# EAGLE design module_flags_reg (EAGLE 6.5.0)

## Sheet 1 of 6
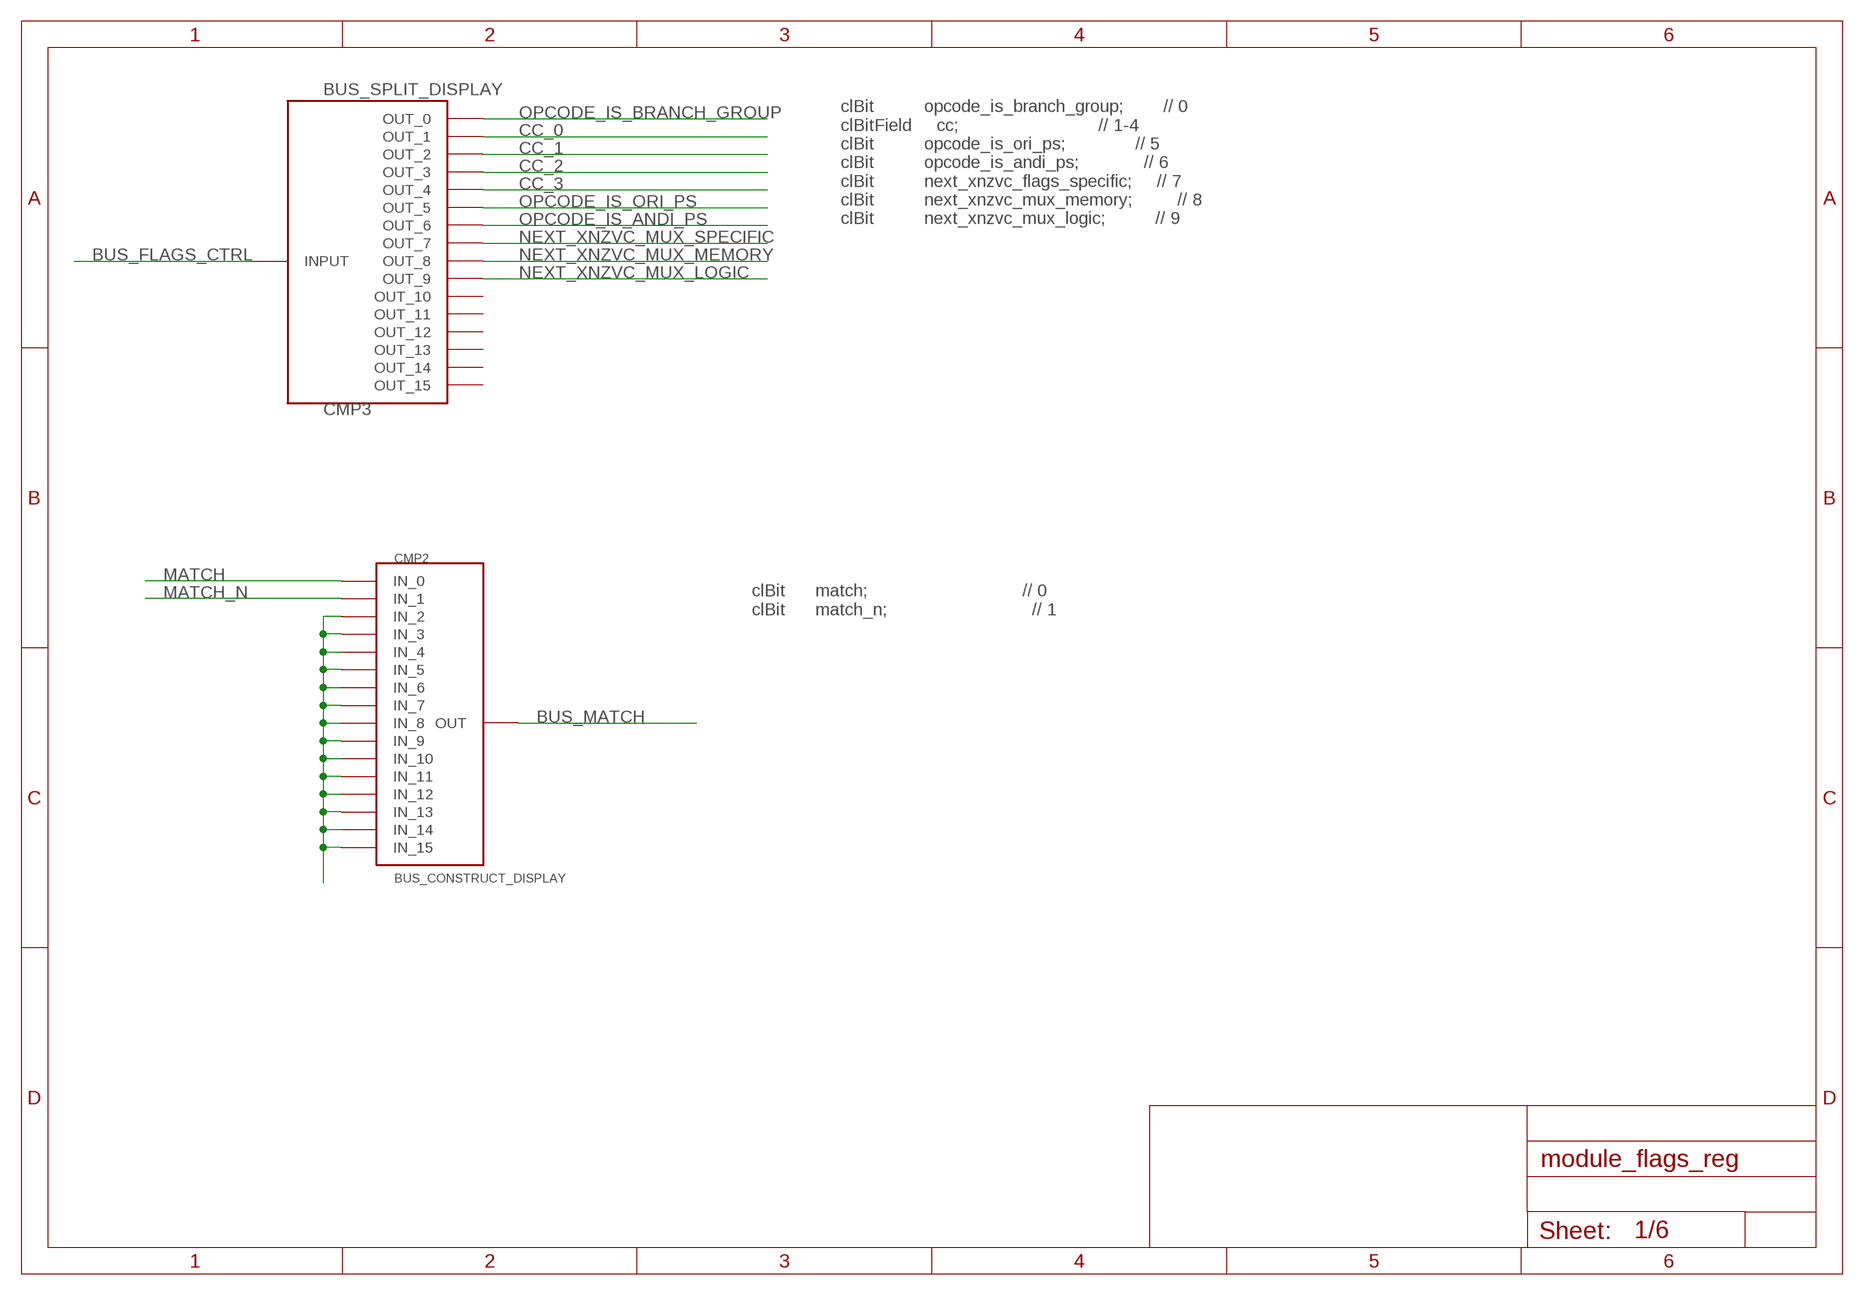
[diagram p0: schematic, sheet 1]

### Parts
CMP2  BUS_CONSTRUCT_DISPLAY  [BUS_SPLIT_DISPLAY]
CMP3  BUS_SPLIT_DISPLAY  [BUS_SPLIT_DISPLAY]

### Nets
BUS_FLAGS_CTRL: CMP3.INPUT
BUS_MATCH: CMP2.INPUT(OUT)
CC_0: CMP3.P$2(OUT_1) ; also sheet 4
CC_1: CMP3.P$3(OUT_2) ; also sheet 4
CC_2: CMP3.P$4(OUT_3) ; also sheet 4
CC_3: CMP3.P$5(OUT_4) ; also sheet 4
MATCH: CMP2.P$1(IN_0) ; also sheet 6
MATCH_N: CMP2.P$2(IN_1) ; also sheet 6
N$6: CMP2.P$3(IN_2) CMP2.P$4(IN_3) CMP2.P$5(IN_4) CMP2.P$6(IN_5) CMP2.P$7(IN_6) CMP2.P$8(IN_7) CMP2.P$9(IN_8) CMP2.P$10(IN_9) CMP2.P$11(IN_10) CMP2.P$12(IN_11) CMP2.P$13(IN_12) CMP2.P$14(IN_13) CMP2.P$15(IN_14) CMP2.P$16(IN_15)
NEXT_XNZVC_MUX_LOGIC: CMP3.P$10(OUT_9) ; also sheet 2
NEXT_XNZVC_MUX_MEMORY: CMP3.P$9(OUT_8) ; also sheet 2
NEXT_XNZVC_MUX_SPECIFIC: CMP3.P$8(OUT_7) ; also sheet 2
OPCODE_IS_ANDI_PS: CMP3.P$7(OUT_6) ; also sheet 3
OPCODE_IS_BRANCH_GROUP: CMP3.P$1(OUT_0) ; also sheet 4
OPCODE_IS_ORI_PS: CMP3.P$6(OUT_5) ; also sheet 3
Unconnected: CMP3.P$11(OUT_10) CMP3.P$12(OUT_11) CMP3.P$13(OUT_12) CMP3.P$14(OUT_13) CMP3.P$15(OUT_14) CMP3.P$16(OUT_15)

### Notes on the sheet
- clBit          opcode_is_branch_group;        // 0
      clBitField     cc;                            // 1-4
      clBit          opcode_is_ori_ps;              // 5
      clBit          opcode_is_andi_ps;             // 6
      clBit          next_xnzvc_flags_specific;     // 7
      clBit          next_xnzvc_mux_memory;         // 8
      clBit          next_xnzvc_mux_logic;          // 9
- clBit      match;                               // 0
      clBit      match_n;                             // 1

## Sheet 2 of 6
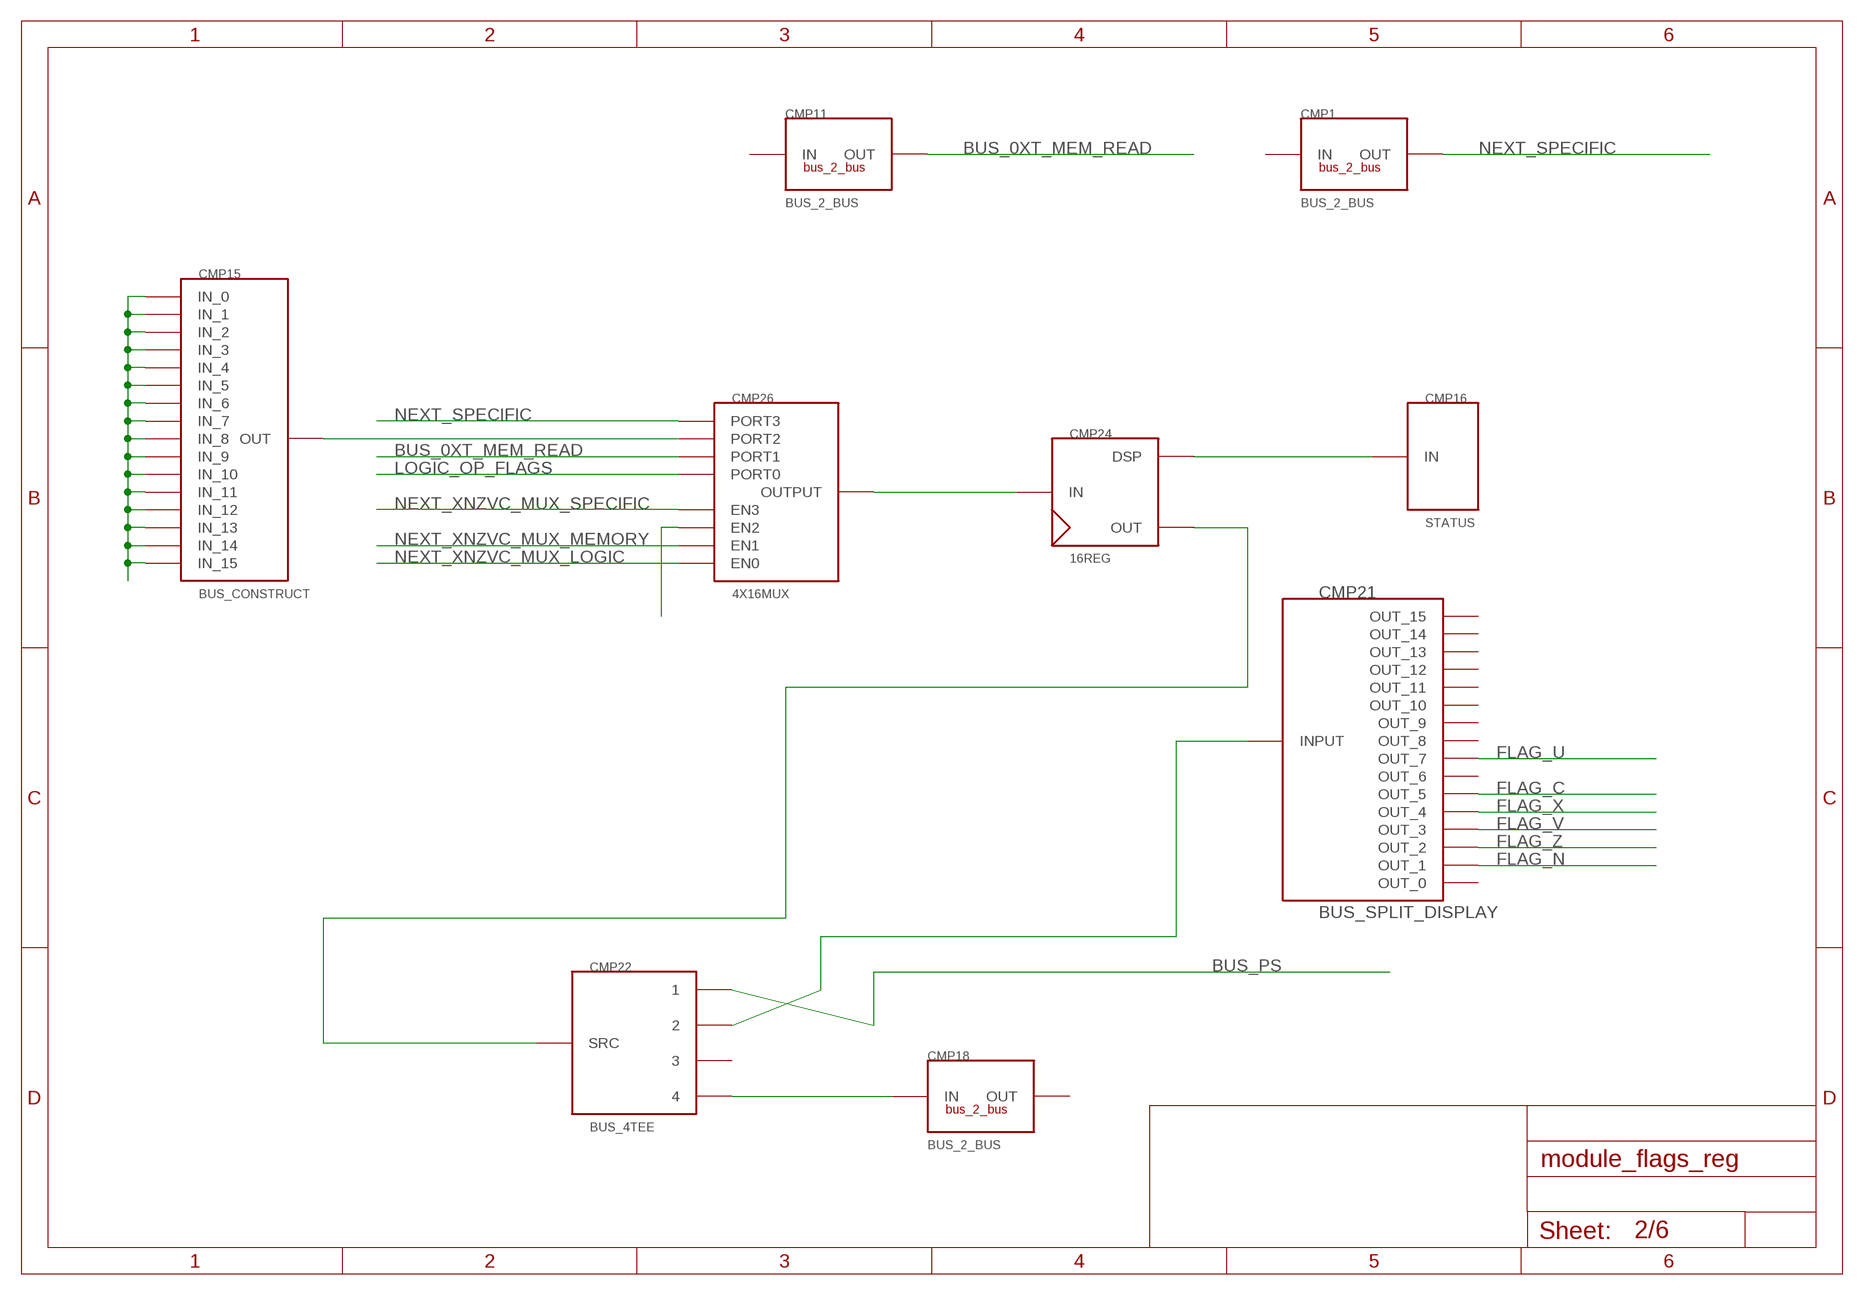
[diagram p1: schematic, sheet 2]

### Parts
CMP1  BUS_2_BUS  [BUS2BUS]
CMP11  BUS_2_BUS  [BUS2BUS]
CMP15  BUS_CONSTRUCT  [BUS_SPLIT]
CMP16  STATUS  [STATUS]
CMP18  BUS_2_BUS  [BUS2BUS]
CMP21  BUS_SPLIT_DISPLAY  [BUS_SPLIT_DISPLAY]
CMP22  BUS_4TEE  [BUS_4TEE]
CMP24  16REG  [16REG]
CMP26  4X16MUX  [4X16MUX]

### Nets
BUS_0XT_MEM_READ: CMP11.P$2(OUT) CMP26.PORT1
BUS_PS: CMP22.1 ; also sheet 3
FLAG_C: CMP21.P$6(OUT_5) ; also sheet 5
FLAG_N: CMP21.P$2(OUT_1) ; also sheet 5
FLAG_U: CMP21.P$8(OUT_7) ; also sheet 5
FLAG_V: CMP21.P$4(OUT_3) ; also sheet 5
FLAG_X: CMP21.P$5(OUT_4)
FLAG_Z: CMP21.P$3(OUT_2) ; also sheet 5
LOGIC_OP_FLAGS: CMP26.PORT0 ; also sheet 3
N$1: CMP16.P$1(IN) CMP24.DISPLAY(DSP)
N$2: CMP22.SRC CMP24.OUT
N$3: CMP18.P$1(IN) CMP22.4
N$4: CMP26.EN2
N$5: CMP15.INPUT(OUT) CMP26.PORT2
N$7: CMP24.INPUT(IN) CMP26.PORTOUT(OUTPUT)
N$11: CMP15.P$1(IN_0) CMP15.P$2(IN_1) CMP15.P$3(IN_2) CMP15.P$4(IN_3) CMP15.P$5(IN_4) CMP15.P$6(IN_5) CMP15.P$7(IN_6) CMP15.P$8(IN_7) CMP15.P$9(IN_8) CMP15.P$10(IN_9) CMP15.P$11(IN_10) CMP15.P$12(IN_11) CMP15.P$13(IN_12) CMP15.P$14(IN_13) CMP15.P$15(IN_14) CMP15.P$16(IN_15)
N$13: CMP21.INPUT CMP22.2
NEXT_SPECIFIC: CMP1.P$2(OUT) CMP26.PORT3
NEXT_XNZVC_MUX_LOGIC: CMP26.EN0 ; also sheet 1
NEXT_XNZVC_MUX_MEMORY: CMP26.EN1 ; also sheet 1
NEXT_XNZVC_MUX_SPECIFIC: CMP26.EN3 ; also sheet 1
Unconnected: CMP1.P$1(IN) CMP11.P$1(IN) CMP18.P$2(OUT) CMP21.P$1(OUT_0) CMP21.P$7(OUT_6) CMP21.P$9(OUT_8) CMP21.P$10(OUT_9) CMP21.P$11(OUT_10) CMP21.P$12(OUT_11) CMP21.P$13(OUT_12) CMP21.P$14(OUT_13) CMP21.P$15(OUT_14) CMP21.P$16(OUT_15) CMP22.3

## Sheet 3 of 6
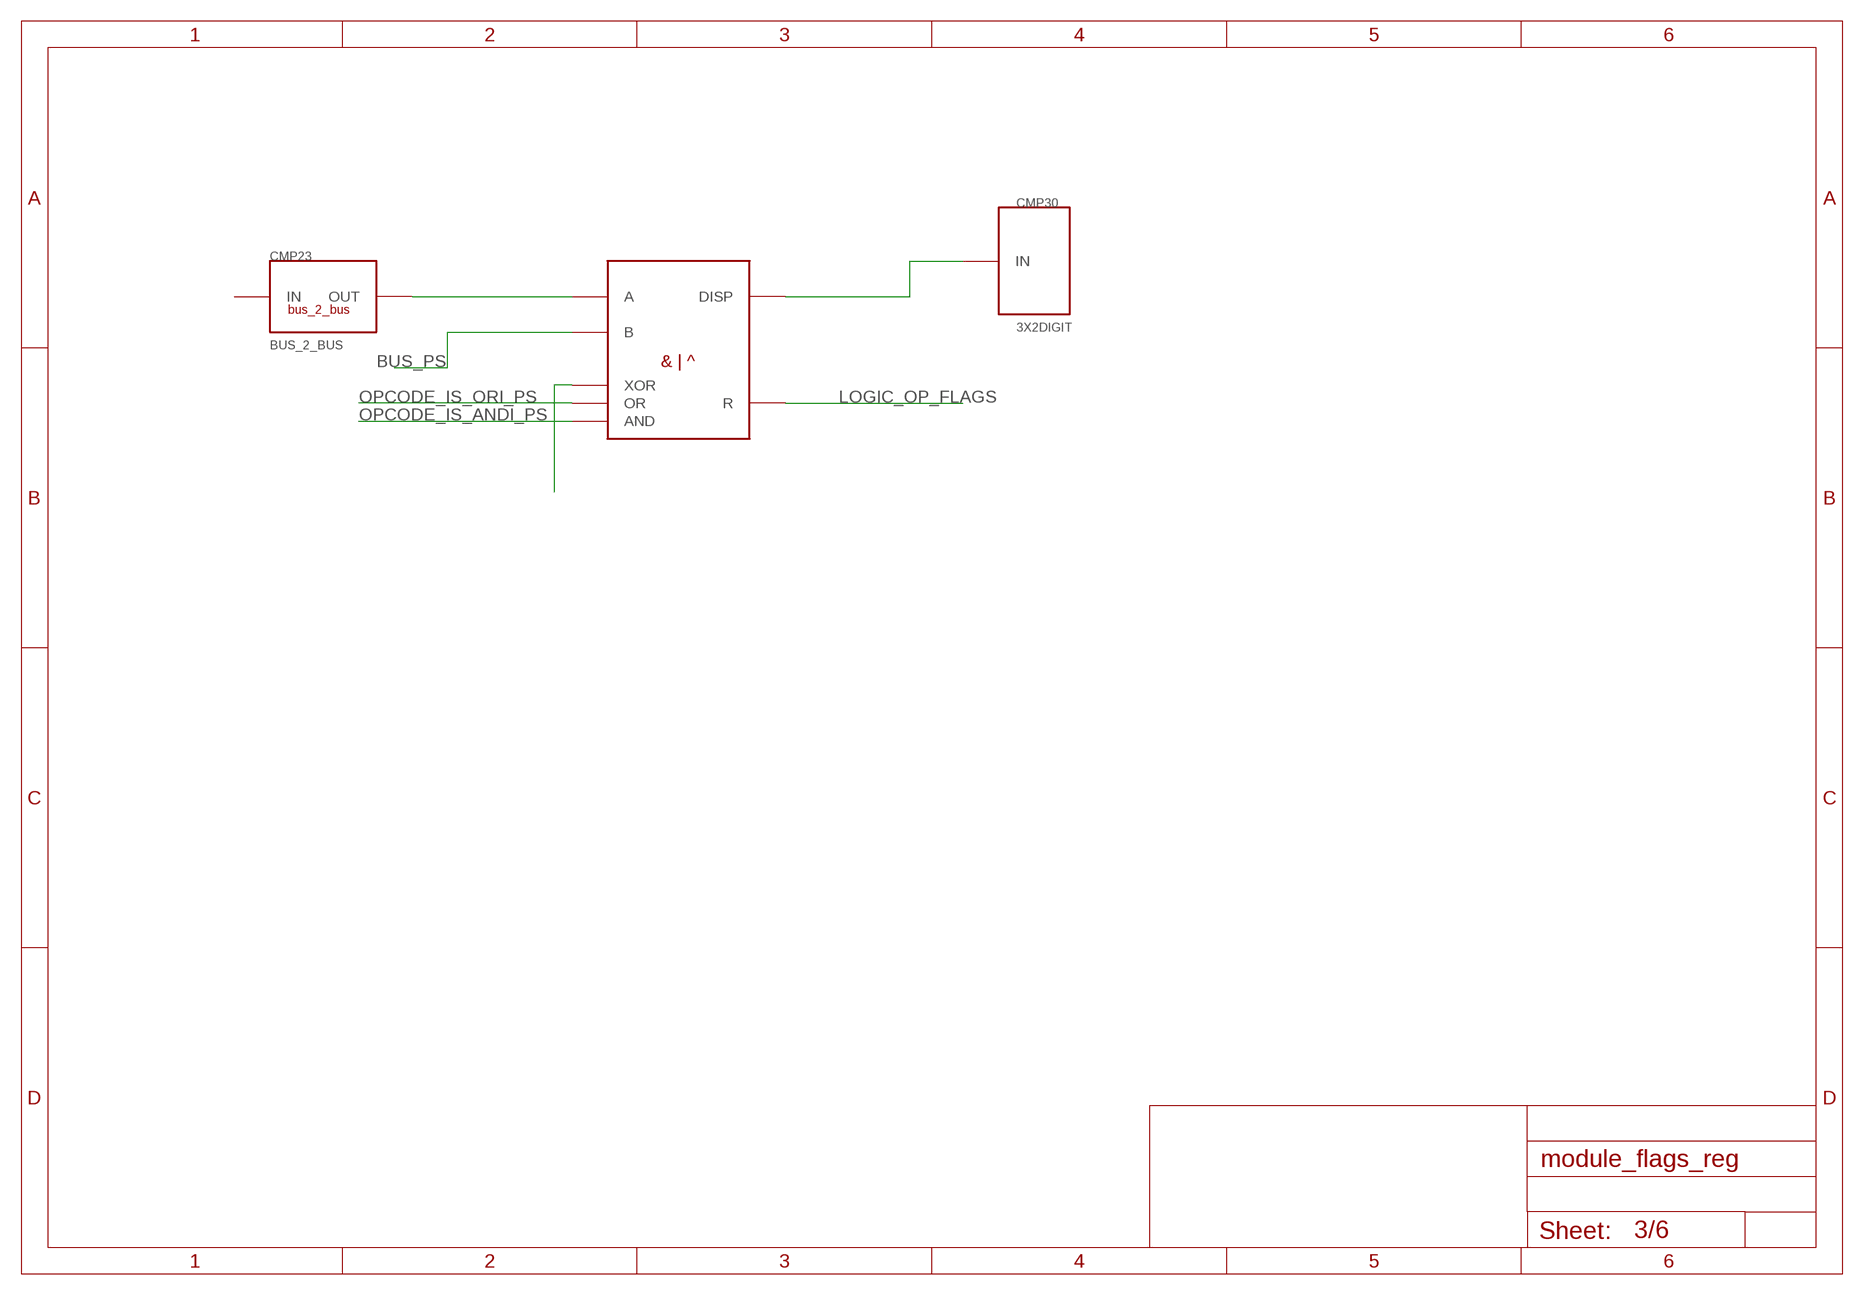
[diagram p2: schematic, sheet 3]

### Parts
CMP23  BUS_2_BUS  [BUS2BUS]
CMP28  8BIT_LOGIC  [8BIT_LOGIC]
CMP30  3X2DIGIT  [3X2DIGIT]

### Nets
BUS_PS: CMP28.B ; also sheet 2
LOGIC_OP_FLAGS: CMP28.R ; also sheet 2
N$9: CMP28.DISP CMP30.P$1(IN)
N$10: CMP28.XOR
N$12: CMP23.P$2(OUT) CMP28.A
OPCODE_IS_ANDI_PS: CMP28.AND ; also sheet 1
OPCODE_IS_ORI_PS: CMP28.OR ; also sheet 1
Unconnected: CMP23.P$1(IN)

## Sheet 4 of 6
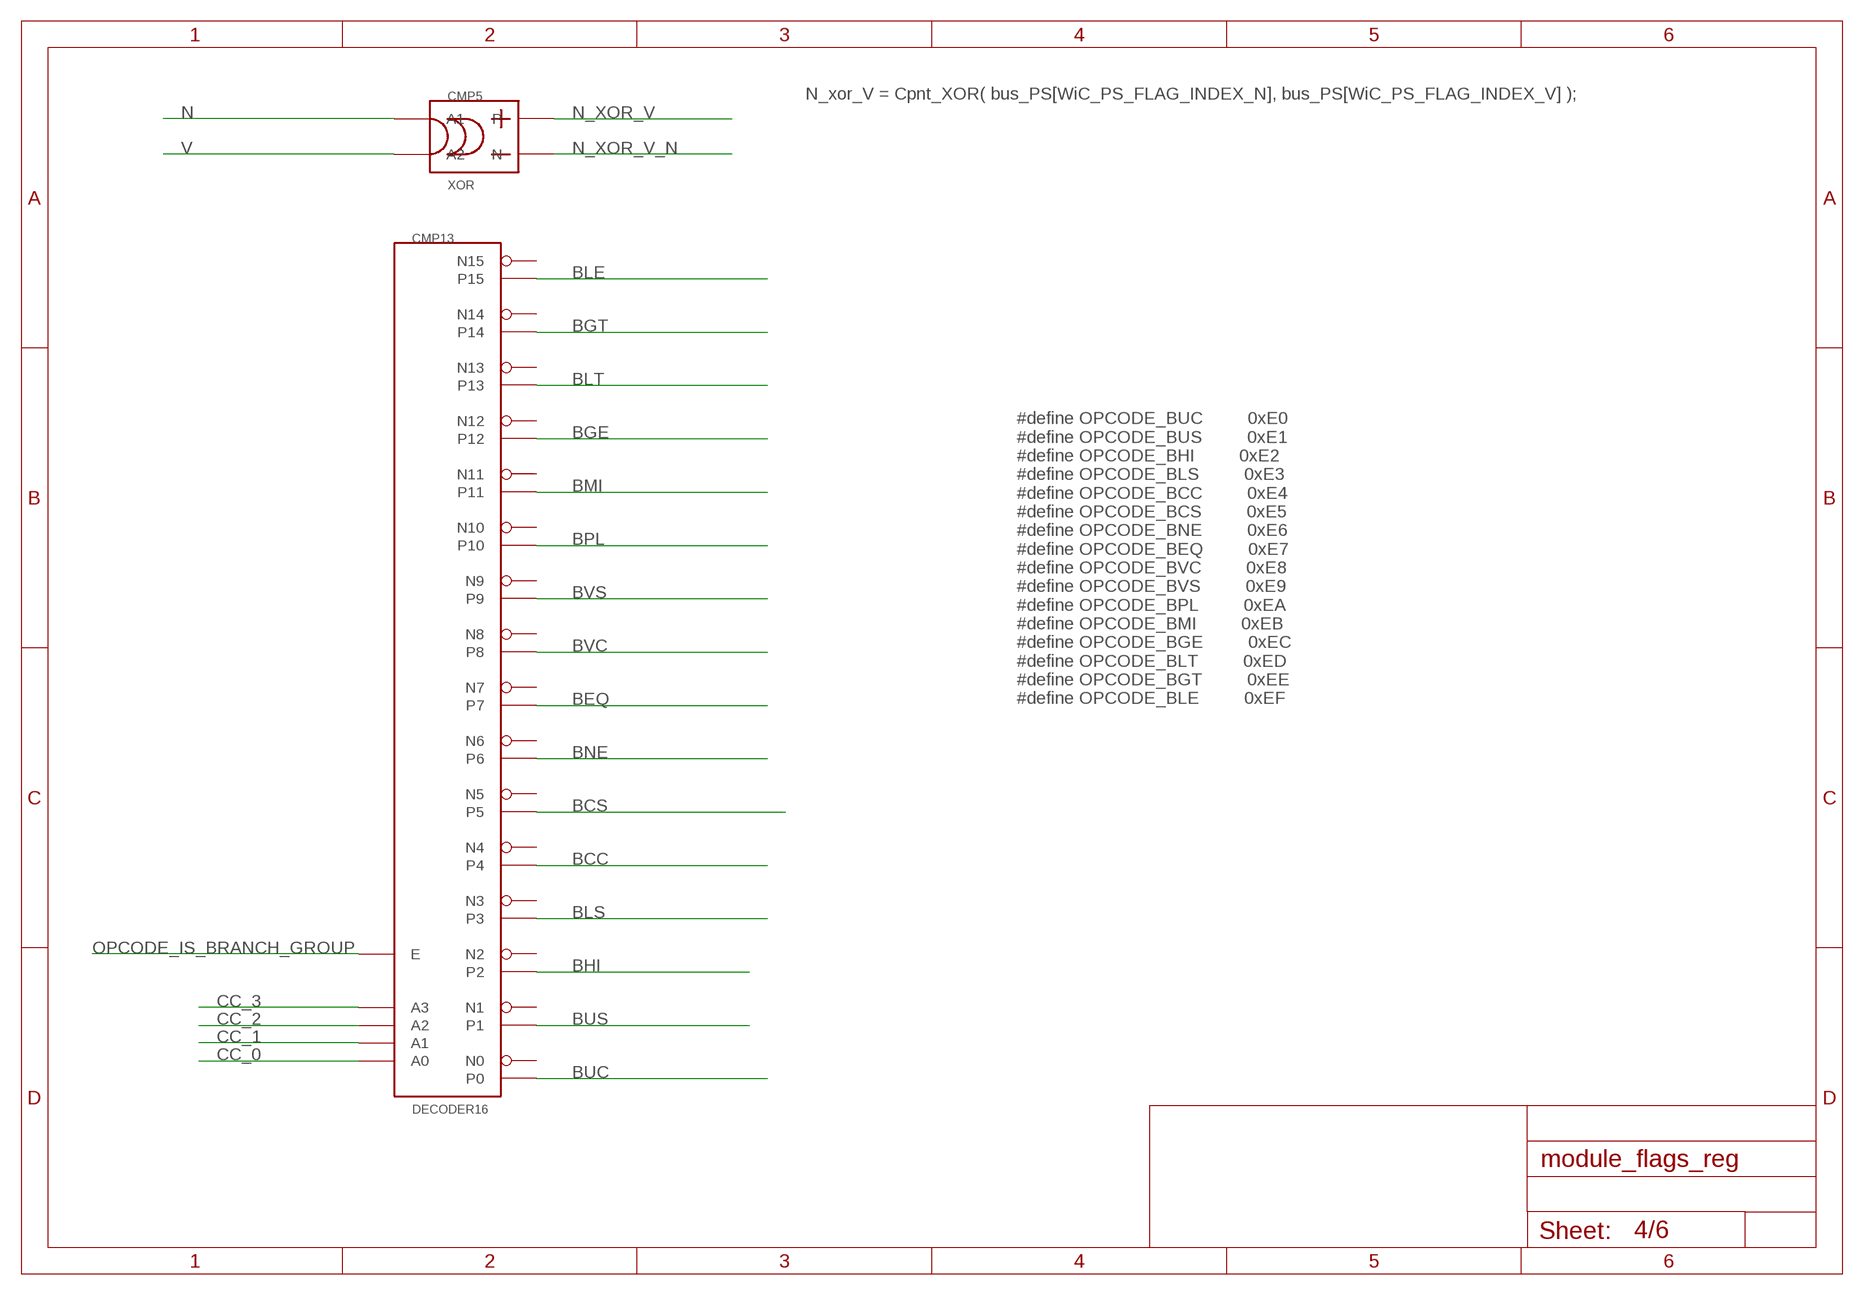
[diagram p3: schematic, sheet 4]

### Parts
CMP5  XOR  [XOR]
CMP13  DECODER16  [DECODER16]

### Nets
BCC: CMP13.P4 ; also sheet 6
BCS: CMP13.P5 ; also sheet 6
BEQ: CMP13.P7 ; also sheet 6
BGE: CMP13.P12 ; also sheet 6
BGT: CMP13.P14 ; also sheet 6
BHI: CMP13.P2 ; also sheet 6
BLE: CMP13.P15 ; also sheet 6
BLS: CMP13.P3 ; also sheet 6
BLT: CMP13.P13 ; also sheet 6
BMI: CMP13.P11 ; also sheet 6
BNE: CMP13.P6 ; also sheet 6
BPL: CMP13.P10 ; also sheet 6
BUC: CMP13.P0 ; also sheet 6
BUS: CMP13.P1 ; also sheet 6
BVC: CMP13.P8 ; also sheet 6
BVS: CMP13.P9 ; also sheet 6
CC_0: CMP13.A0 ; also sheet 1
CC_1: CMP13.A1 ; also sheet 1
CC_2: CMP13.A2 ; also sheet 1
CC_3: CMP13.A3 ; also sheet 1
N: CMP5.P$1(A1) ; also sheet 5,6
N_XOR_V: CMP5.OUT_P(P) ; also sheet 5,6
N_XOR_V_N: CMP5.OUT_N(N) ; also sheet 5,6
OPCODE_IS_BRANCH_GROUP: CMP13.E ; also sheet 1
V: CMP5.P$2(A2) ; also sheet 5,6
Unconnected: CMP13.N0 CMP13.N1 CMP13.N2 CMP13.N3 CMP13.N4 CMP13.N5 CMP13.N6 CMP13.N7 CMP13.N8 CMP13.N9 CMP13.N10 CMP13.N11 CMP13.N12 CMP13.N13 CMP13.N14 CMP13.N15

### Notes on the sheet
- N_xor_V = Cpnt_XOR( bus_PS[WiC_PS_FLAG_INDEX_N], bus_PS[WiC_PS_FLAG_INDEX_V] );
- #define OPCODE_BUC         0xE0
  #define OPCODE_BUS         0xE1
  #define OPCODE_BHI         0xE2
  #define OPCODE_BLS         0xE3
  #define OPCODE_BCC         0xE4
  #define OPCODE_BCS         0xE5
  #define OPCODE_BNE         0xE6
  #define OPCODE_BEQ         0xE7
  #define OPCODE_BVC         0xE8
  #define OPCODE_BVS         0xE9
  #define OPCODE_BPL         0xEA
  #define OPCODE_BMI         0xEB
  #define OPCODE_BGE         0xEC
  #define OPCODE_BLT         0xED
  #define OPCODE_BGT         0xEE
  #define OPCODE_BLE         0xEF

## Sheet 5 of 6
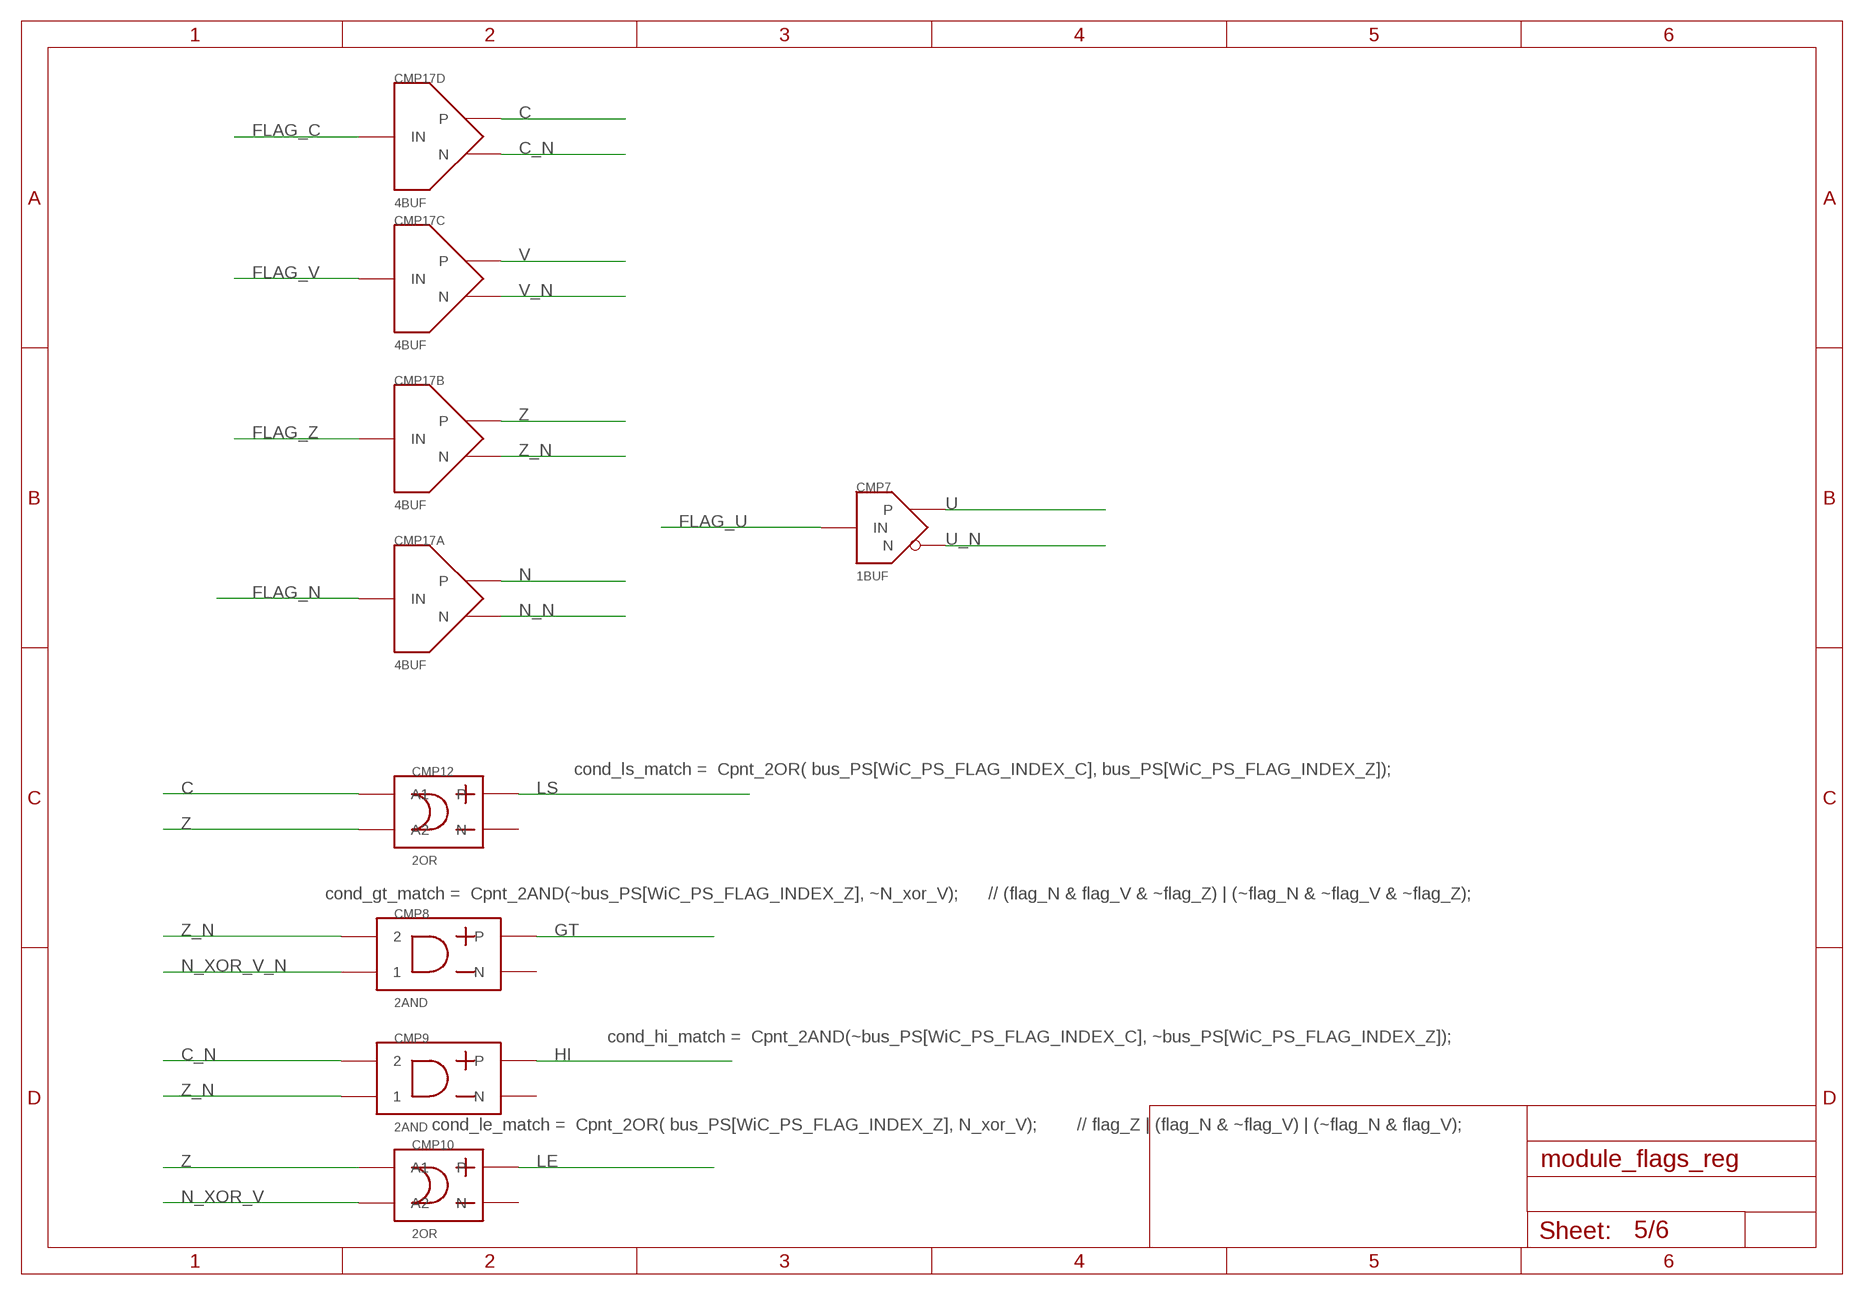
[diagram p4: schematic, sheet 5]

### Parts
CMP7  1BUF  [1BUF]
CMP8  2AND  [2AND]
CMP9  2AND  [2AND]
CMP10  2OR  [2OR]
CMP12  2OR  [2OR]
CMP17  4BUF  [4BUF]

### Nets
C: CMP12.P$2(A1) CMP17.P4(D:P) ; also sheet 6
C_N: CMP9.P$2 CMP17.N4(D:N) ; also sheet 6
FLAG_C: CMP17.A4(D:IN) ; also sheet 2
FLAG_N: CMP17.A1(A:IN) ; also sheet 2
FLAG_U: CMP7.IN ; also sheet 2
FLAG_V: CMP17.A3(C:IN) ; also sheet 2
FLAG_Z: CMP17.A2(B:IN) ; also sheet 2
GT: CMP8.OUT_P(P) ; also sheet 6
HI: CMP9.OUT_P(P) ; also sheet 6
LE: CMP10.OUT_P(P) ; also sheet 6
LS: CMP12.OUT_P(P) ; also sheet 6
N: CMP17.P1(A:P) ; also sheet 4,6
N_N: CMP17.N1(A:N) ; also sheet 6
N_XOR_V: CMP10.P$1(A2) ; also sheet 4,6
N_XOR_V_N: CMP8.P$1 ; also sheet 4,6
U: CMP7.P ; also sheet 6
U_N: CMP7.N ; also sheet 6
V: CMP17.P3(C:P) ; also sheet 4,6
V_N: CMP17.N3(C:N) ; also sheet 6
Z: CMP10.P$2(A1) CMP12.P$1(A2) CMP17.P2(B:P) ; also sheet 6
Z_N: CMP8.P$2 CMP9.P$1 CMP17.N2(B:N) ; also sheet 6
Unconnected: CMP8.OUT_M(N) CMP9.OUT_M(N) CMP10.OUT_M(N) CMP12.OUT_M(N)

### Notes on the sheet
- cond_ls_match =  Cpnt_2OR( bus_PS[WiC_PS_FLAG_INDEX_C], bus_PS[WiC_PS_FLAG_INDEX_Z]);
- cond_gt_match =  Cpnt_2AND(~bus_PS[WiC_PS_FLAG_INDEX_Z], ~N_xor_V);      // (flag_N & flag_V & ~flag_Z) | (~flag_N & ~flag_V & ~flag_Z);
- cond_hi_match =  Cpnt_2AND(~bus_PS[WiC_PS_FLAG_INDEX_C], ~bus_PS[WiC_PS_FLAG_INDEX_Z]);
- cond_le_match =  Cpnt_2OR( bus_PS[WiC_PS_FLAG_INDEX_Z], N_xor_V);        // flag_Z | (flag_N & ~flag_V) | (~flag_N & flag_V);

## Sheet 6 of 6
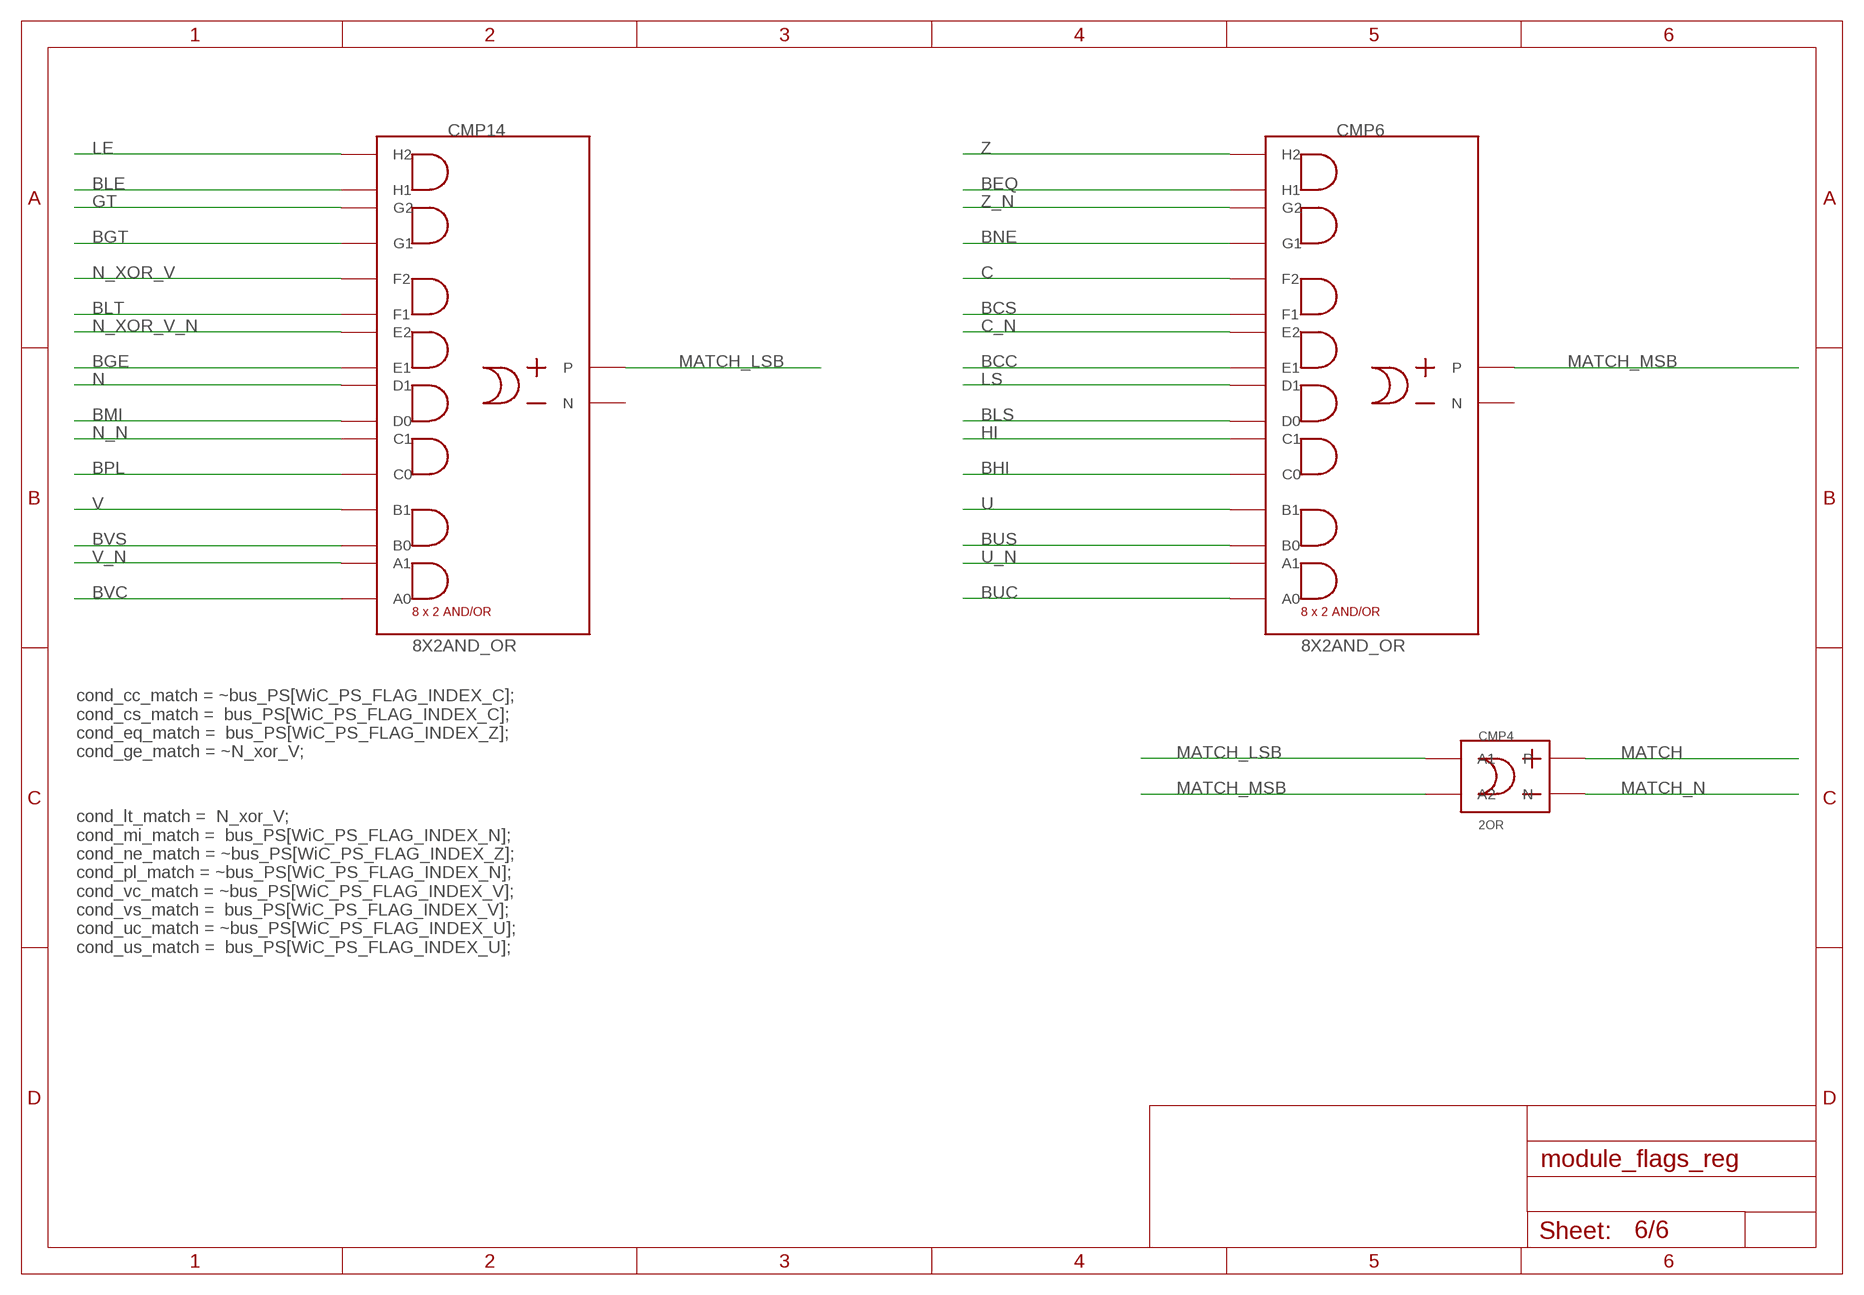
[diagram p5: schematic, sheet 6]

### Parts
CMP4  2OR  [2OR]
CMP6  8X2AND_OR  [8X2AND_OR]
CMP14  8X2AND_OR  [8X2AND_OR]

### Nets
BCC: CMP6.P$9(E1) ; also sheet 4
BCS: CMP6.P$11(F1) ; also sheet 4
BEQ: CMP6.P$15(H1) ; also sheet 4
BGE: CMP14.P$9(E1) ; also sheet 4
BGT: CMP14.P$13(G1) ; also sheet 4
BHI: CMP6.P$5(C0) ; also sheet 4
BLE: CMP14.P$15(H1) ; also sheet 4
BLS: CMP6.P$7(D0) ; also sheet 4
BLT: CMP14.P$11(F1) ; also sheet 4
BMI: CMP14.P$7(D0) ; also sheet 4
BNE: CMP6.P$13(G1) ; also sheet 4
BPL: CMP14.P$5(C0) ; also sheet 4
BUC: CMP6.P$1(A0) ; also sheet 4
BUS: CMP6.P$3(B0) ; also sheet 4
BVC: CMP14.P$1(A0) ; also sheet 4
BVS: CMP14.P$3(B0) ; also sheet 4
C: CMP6.P$12(F2) ; also sheet 5
C_N: CMP6.P$10(E2) ; also sheet 5
GT: CMP14.P$14(G2) ; also sheet 5
HI: CMP6.P$6(C1) ; also sheet 5
LE: CMP14.P$16(H2) ; also sheet 5
LS: CMP6.P$8(D1) ; also sheet 5
MATCH: CMP4.OUT_P(P) ; also sheet 1
MATCH_LSB: CMP4.P$2(A1) CMP14.OUT_P(P)
MATCH_MSB: CMP4.P$1(A2) CMP6.OUT_P(P)
MATCH_N: CMP4.OUT_M(N) ; also sheet 1
N: CMP14.P$8(D1) ; also sheet 4,5
N_N: CMP14.P$6(C1) ; also sheet 5
N_XOR_V: CMP14.P$12(F2) ; also sheet 4,5
N_XOR_V_N: CMP14.P$10(E2) ; also sheet 4,5
U: CMP6.P$4(B1) ; also sheet 5
U_N: CMP6.P$2(A1) ; also sheet 5
V: CMP14.P$4(B1) ; also sheet 4,5
V_N: CMP14.P$2(A1) ; also sheet 5
Z: CMP6.P$16(H2) ; also sheet 5
Z_N: CMP6.P$14(G2) ; also sheet 5
Unconnected: CMP6.OUT_M(N) CMP14.OUT_M(N)

### Notes on the sheet
- cond_cc_match = ~bus_PS[WiC_PS_FLAG_INDEX_C];
      cond_cs_match =  bus_PS[WiC_PS_FLAG_INDEX_C];
      cond_eq_match =  bus_PS[WiC_PS_FLAG_INDEX_Z];
      cond_ge_match = ~N_xor_V;
- cond_lt_match =  N_xor_V;                                        
      cond_mi_match =  bus_PS[WiC_PS_FLAG_INDEX_N];
      cond_ne_match = ~bus_PS[WiC_PS_FLAG_INDEX_Z];
      cond_pl_match = ~bus_PS[WiC_PS_FLAG_INDEX_N];
      cond_vc_match = ~bus_PS[WiC_PS_FLAG_INDEX_V];
      cond_vs_match =  bus_PS[WiC_PS_FLAG_INDEX_V];
      cond_uc_match = ~bus_PS[WiC_PS_FLAG_INDEX_U];
      cond_us_match =  bus_PS[WiC_PS_FLAG_INDEX_U];

## Library data of the parts
CMP1 CMP11 CMP18 CMP23 = modules:BUS_2_BUS
CMP2 = modules:BUS_CONSTRUCT_DISPLAY
CMP3 CMP21 = modules:BUS_SPLIT_DISPLAY
CMP4 CMP10 CMP12 = modules:2OR
CMP5 = modules:XOR
CMP6 CMP14 = modules:8X2AND_OR
CMP7 = modules:1BUF
CMP8 CMP9 = modules:2AND
CMP13 = modules:DECODER16
CMP15 = modules:BUS_CONSTRUCT
CMP16 = modules:STATUS
CMP17 = modules:4BUF
CMP22 = modules:BUS_4TEE
CMP24 = modules:16REG
CMP26 = modules:4X16MUX
CMP28 = modules:8BIT_LOGIC
CMP30 = modules:3X2DIGIT

## Board
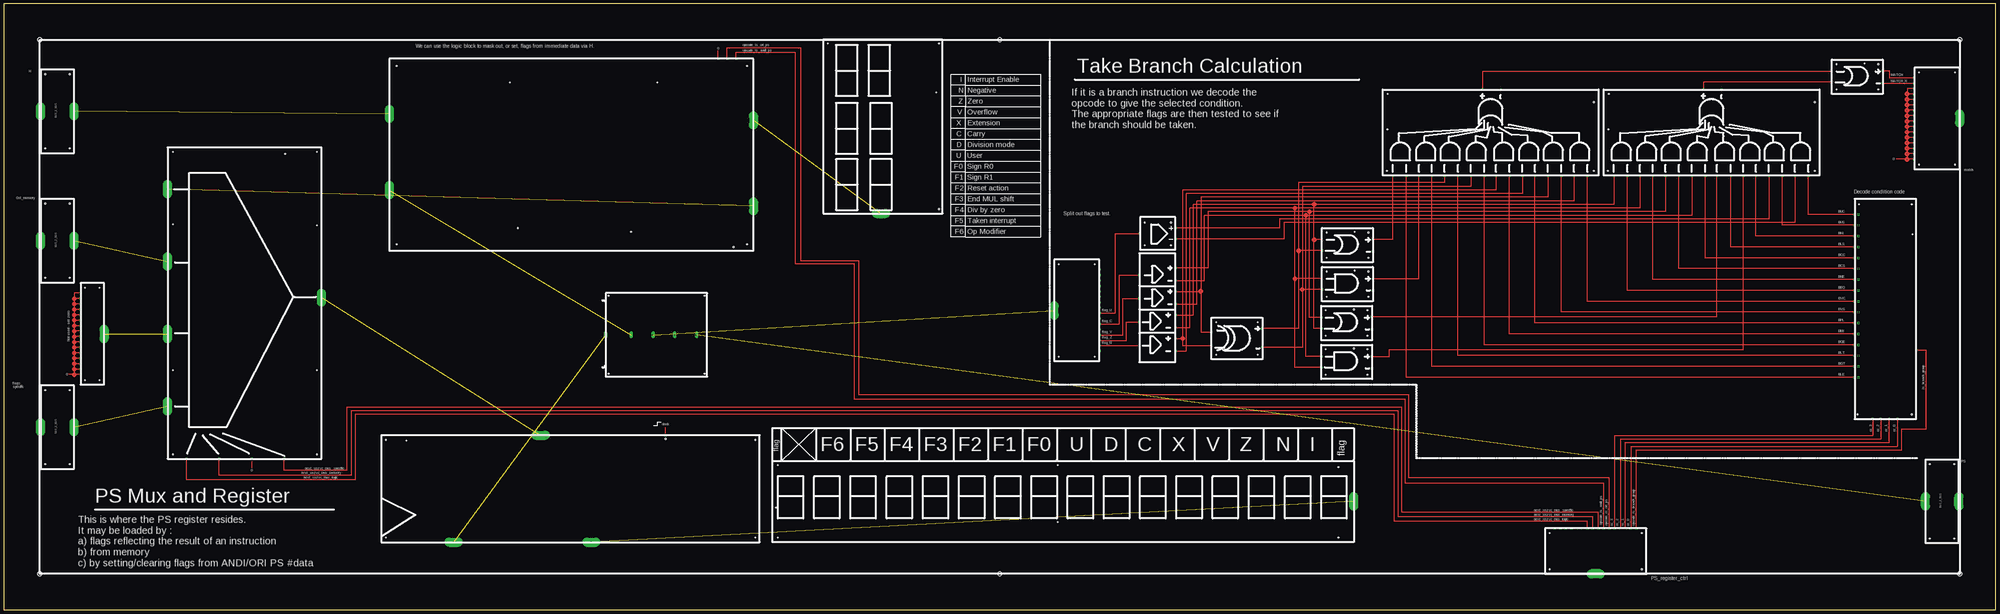
[diagram p6: board, top side]

Size 1397 x 425.45 mm. Coordinates in mm from the lower left corner, seen from the top.
Outline: 0,0 1397,0 1397,425.45 0,425.45 0,0
Copper layers (1*16): Top 0.035mm / dielectric 1.5mm / Bottom 0.035mm
Design rules "default": minimum track width 10mil, minimum drill 24mil, track to track 8mil, track to pad 8mil, pad to pad 8mil, via to via 8mil, smd to smd 8mil, copper to edge 40mil, drill to drill 8mil, minimum pad ring 10mil, minimum via ring 8mil, stop-mask expansion 4mil, vias tented up to drill 0mil, thermal gap 10mil
Holes 2.8 mm at 25.4,400.05 25.4,25.4 698.5,25.4 698.5,400.05 1371.6,400.05 1371.6,25.4
tKeepout: area 16.3,16.3 to 34.5,34.5; area 16.3,390.9 to 34.5,409.2; area 689.4,16.3 to 707.6,34.5; area 689.4,390.9 to 707.6,409.2; area 1362.5,16.3 to 1380.7,34.5; area 1362.5,390.9 to 1380.7,409.2

### Footprints (pad centres in the part's own frame; a part is rotated, then mirrored left to right if it is on the bottom)
BUS2BUS = drill 0.8 pad 6.452 long: P$1 -1.27,12.7; P$2 -1.27,-10.795 | hole 0.6: -27.305,-7.62; -27.305,9.525; 24.765,9.525; 24.765,-7.62
BUS_SPLIT_DISPLAY = drill 0.8 pad 6.452 long: INPUT 0,15.24 | drill 0.8 square: P$1 -28.575,-16.51; P$2 -24.765,-16.51; P$3 -20.955,-16.51; P$4 -17.145,-16.51; P$5 -13.335,-16.51; P$6 -9.525,-16.51; P$7 -5.715,-16.51; P$8 -1.905,-16.51; P$9 1.905,-16.51; P$10 5.715,-16.51; P$11 9.525,-16.51; P$12 13.335,-16.51; P$13 17.145,-16.51; P$14 20.955,-16.51; P$15 24.765,-16.51; P$16 28.575,-16.51 | hole 0.6: -32.385,-13.335; -32.385,12.065; 32.385,12.065; 32.385,-13.335
2OR = drill 0.8 square: OUT_M 17.78,-4.445; OUT_P 17.78,4.445; P$1 -17.78,-3.81; P$2 -17.78,3.81 | hole 0.6: -14.605,8.89; 14.605,-8.89; 14.605,8.89; -14.605,-8.89; 5.08,9.525
XOR = drill 0.8 square: OUT_N 17.78,-6.985; OUT_P 17.78,6.35; P$1 -17.78,-5.715; P$2 -17.78,3.81 | hole 0.6: -14.605,10.795; 14.605,-12.065; 14.605,10.795; -14.605,-12.065
8X2AND_OR = drill 0.8 square: OUT_M 29.845,-8.89; OUT_P 29.845,3.81; P$1 -30.48,-69.85; P$2 -30.48,-60.325; P$3 -30.48,-51.435; P$4 -30.48,-41.91; P$5 -30.48,-33.02; P$6 -30.48,-24.13; P$7 -30.48,-15.24; P$8 -30.48,-5.715; P$9 -30.48,2.54; P$10 -30.48,12.065; P$11 -30.48,20.955; P$12 -30.48,30.48; P$13 -30.48,39.37; P$14 -30.48,48.26; P$15 -30.48,57.15; P$16 -30.48,66.675 | hole 0.6: -27.305,-74.295; 20.955,-74.295; 26.67,70.168; -27.305,70.802; 1.905,70.485
1BUF = drill 0.8 square: IN -12.7,0; N 12.065,-3.81; P 12.065,3.81 | hole 0.6: -9.525,7.62; -9.525,-8.255; 8.89,-8.255; 8.89,7.62
2AND = drill 0.8 square: OUT_M 19.05,-4.445; OUT_P 19.05,3.81; P$1 -16.51,-3.81; P$2 -16.51,3.81 | hole 0.6: -13.335,8.89; 15.875,-8.89; -13.335,-8.89; 15.875,8.89; 6.35,9.525
DECODER16 = drill 0.8 square: A0 -83.82,-8.255; A1 -83.82,-2.54; A2 -83.82,3.175; A3 -83.82,8.89; E -35.56,-21.59; N0 59.69,19.05; N1 52.07,19.05; N2 44.45,19.05; N3 36.83,19.05; N4 29.21,19.05; N5 21.59,19.05; N6 13.97,19.05; N7 6.35,19.05; N8 -1.27,19.05; N9 -8.89,19.05; N10 -16.51,19.05; N11 -24.13,19.05; N12 -31.75,19.05; N13 -39.37,19.05; N14 -46.99,19.05; N15 -54.61,19.05; P0 59.69,21.59; P1 52.07,21.59; P2 44.45,21.59; P3 36.83,21.59; P4 29.21,21.59; P5 21.59,21.59; P6 13.97,21.59; P7 6.35,21.59; P8 -1.27,21.59; P9 -8.89,21.59; P10 -16.51,21.59; P11 -24.13,21.59; P12 -31.75,21.59; P13 -39.37,21.59; P14 -46.99,21.59; P15 -54.61,21.59 | hole 0.6: 66.675,18.415; -80.645,19.685; -80.645,-18.415; 66.675,-18.415; 45.72,-19.05
BUS_SPLIT = drill 0.8 pad 6.452 long: INPUT -0.635,7.62 | drill 0.8 square: P$1 -29.21,-8.89; P$2 -25.4,-8.89; P$3 -21.59,-8.89; P$4 -17.78,-8.89; P$5 -13.97,-8.89; P$6 -10.16,-8.89; P$7 -6.35,-8.89; P$8 -2.54,-8.89; P$9 1.27,-8.89; P$10 5.08,-8.89; P$11 8.89,-8.89; P$12 12.7,-8.89; P$13 16.51,-8.89; P$14 20.32,-8.89; P$15 24.13,-8.89; P$16 27.94,-8.89 | hole 0.6: -33.02,-5.715; -33.02,4.445; 31.75,4.445; 31.75,-5.715
STATUS = drill 0.8 pad 6.452 long: P$1 208.28,-2.54 | hole 0.6: -195.58,-27.94; -195.58,22.86; 197.485,-27.94; 197.485,21.59; 0.635,22.86; 0.635,-17.145; -196.85,-6.985
4BUF = drill 0.8 square: A1 -25.4,13.97; A2 -8.89,13.97; A3 7.62,13.97; A4 24.13,13.97; N1 -29.21,-11.43; N2 -12.7,-11.43; N3 3.81,-11.43; N4 20.32,-11.43; P1 -20.32,-11.43; P2 -3.81,-11.43; P3 12.7,-11.43; P4 29.21,-11.43
BUS_4TEE = drill 0.8 pad 2.54 long: 1 2.54,12.7; 2 2.54,-2.54; 3 2.54,-17.78; 4 2.54,-33.02; SRC 2.54,30.48 | hole 0.6: -24.765,28.575; 29.845,28.575; 29.845,-38.735; -24.765,-38.735
16REG = drill 0.8 pad 6.452 long: DISPLAY 17.78,-33.02; INPUT -17.78,41.91; OUT -78.74,-33.02 | drill 0.8 square: P$1 69.85,41.91 | hole 0.6: -126.365,-29.845; -126.365,38.735; 132.715,38.735; 132.715,-29.845; -111.76,38.1; 69.85,39.37
4X16MUX = drill 0.8 square: EN0 -113.03,38.735; EN1 -113.03,15.875; EN2 -113.03,-6.985; EN3 -113.03,-29.845 | drill 0.8 pad 6.452 long: PORT0 76.2,52.07; PORT1 25.4,52.07; PORT2 -25.4,52.07; PORT3 -76.2,52.07; PORTOUT 0,-55.88 | hole 0.6: -109.855,-52.705; -50.8,-52.705; 50.8,-52.705; 102.235,-52.705; 102.235,48.26; 51.435,48.26; -50.8,48.26; -109.855,48.26; 100.965,-30.48
8BIT_LOGIC = drill 0.8 pad 6.452 long: A -29.845,-140.97; B 23.495,-140.97; DISP -25.4,114.3; R 34.925,114.3 | drill 0.8 square: AND -68.58,102.235; OR -68.58,95.885; XOR -68.58,89.535 | hole 0.6: -63.5,-135.89; -63.5,109.855; 61.595,109.855; 61.595,-135.89; 63.5,100.33; -52.07,46.99; 52.705,28.575; -52.07,-56.515; 50.165,-50.8
3X2DIGIT = drill 0.8 pad 6.452 long: P$1 -0.635,-60.96 | hole 0.6: 38.1,24.13; 40.005,-57.785; 40.005,58.42; -38.1,58.42

### Placement (x,y rotation side)
CMP1  38.73,129.54 90 top
CMP2  1356.36,344.81 270 top
CMP3  1116.33,40.64 180 top
CMP4  1299.85,374.01 0 top
CMP5  864.87,191.13 0 top
CMP6  1195.7,335.28 90 top
CMP7  809.62,264.16 0 top
CMP8  941.07,228.6 0 top
CMP9  940.43,173.99 0 top
CMP10  942.34,255.91 0 top
CMP11  38.73,260.35 90 top
CMP12  941.71,201.29 0 top
CMP13  1319.53,217.81 90 top
CMP14  1040.77,335.28 90 top
CMP15  62.87,193.04 270 top
CMP16  738.5,78.74 0 top
CMP17  810.26,210.82 90 top
CMP18  1360.17,77.47 90 top
CMP21  751.84,210.19 90 top
CMP22  452.75,190.5 90 top
CMP23  38.73,351.15 90 top
CMP24  394.33,80.64 0 top
CMP26  167,219.07 90 top
CMP28  411.48,318.13 270 top
CMP30  615.95,339.09 0 top

### Tracks (layer width: path | path; a pad name or v marks a point on that pad's centre or on a via)
BCC
  Top 0.61: CMP13.P4 1193.16,247.01 CMP6.P$9
BCS
  Top 0.61: CMP13.P5 1174.75,239.4 CMP6.P$11
BEQ
  Top 0.61: CMP13.P7 1138.56,224.16 CMP6.P$15
BGE
  Top 0.61: CMP13.P12 1038.22,186.06 CMP14.P$9
BGT
  Top 0.61: CMP13.P14 1001.39,170.81 CMP14.P$13
BHI
  Top 0.61: CMP13.P2 1228.72,262.25 CMP6.P$5
BLE
  Top 0.61: CMP13.P15 983.62,163.19 CMP14.P$15
BLS
  Top 0.61: CMP13.P3 1210.94,254.63 CMP6.P$7
BLT
  Top 0.61: CMP13.P13 1019.81,178.44 CMP14.P$11
BMI
  Top 0.61: CMP13.P11 1056.01,193.68 CMP14.P$7
BNE
  Top 0.61: CMP13.P6 1156.34,231.78 CMP6.P$13
BPL
  Top 0.61: CMP13.P10 1073.79,201.29 CMP14.P$5
BUC
  Top 0.61: CMP13.P0 1265.56,277.5 CMP6.P$1
BUS
  Top 0.61: CMP13.P1 1247.14,269.88 CMP6.P$3
BUS_0XT_MEM_READ  (1 unrouted)
BUS_PS  (1 unrouted)
BVC
  Top 0.61: CMP13.P8 1110.62,216.53 CMP14.P$1
BVS
  Top 0.61: CMP13.P9 1092.2,208.91 CMP14.P$3
C
  Top 0.61: CMP6.P$12 1165.22,279.4 915.67,279.4 | 915.67,279.4 844.55,279.4 844.55,240.03 CMP17.P4 | CMP12.P$2 915.67,205.1 915.67,279.4
C_N
  Top 0.61: CMP6.P$10 1183.64,276.86 913.13,276.86 | 913.13,276.86 842.01,276.86 842.01,231.14 CMP17.N4 | CMP9.P$2 913.13,177.8 913.13,276.86
CC_0
  Top 0.61: CMP13.A0 1327.79,114.94 1141.1,114.94 CMP3.P$2
CC_1
  Top 0.61: CMP13.A1 1322.07,117.47 1137.29,117.47 CMP3.P$3
CC_2
  Top 0.61: CMP13.A2 1316.36,120.02 1133.47,120.02 CMP3.P$4
CC_3
  Top 0.61: CMP13.A3 1310.64,122.56 1129.66,122.56 CMP3.P$5
FLAG_C
  Top 0.61: CMP21.P$6 782.32,200.66 782.32,234.95 CMP17.A4
FLAG_N
  Top 0.61: CMP21.P$2 CMP17.A1
FLAG_U
  Top 0.61: CMP21.P$8 779.78,208.28 779.78,264.16 CMP7.IN
FLAG_V
  Top 0.61: CMP21.P$4 784.86,193.04 784.86,218.44 CMP17.A3
FLAG_Z
  Top 0.61: CMP21.P$3 787.4,189.23 787.4,201.93 CMP17.A2
GT
  Top 0.61: CMP8.OUT_P 992.5,232.41 CMP14.P$14
HI
  Top 0.61: CMP9.OUT_P 971.55,177.8 971.55,182.88 1219.84,182.88 CMP6.P$6
LE
  Top 0.61: CMP10.OUT_P 974.09,260.35 CMP14.P$16
LOGIC_OP_FLAGS  (1 unrouted)
LS
  Top 0.61: CMP12.OUT_P 1201.42,205.74 CMP6.P$8
MATCH
  Top 0.61: CMP4.OUT_P 1322.07,378.46 1322.07,373.38 CMP2.P$1
MATCH_LSB
  Top 0.61: CMP4.P$2 1036.95,377.82 CMP14.OUT_P
MATCH_MSB
  Top 0.61: CMP4.P$1 1191.89,370.2 CMP6.OUT_P
MATCH_N
  Top 0.61: CMP4.OUT_M CMP2.P$2
N
  Top 0.61: CMP14.P$8 1046.48,294.64 826.77,294.64 826.77,190.5 | 826.77,190.5 826.77,185.42 CMP5.P$1 | CMP17.P1 826.77,190.5
N$1  (1 unrouted)
N$2  (1 unrouted)
N$3  (1 unrouted)
N$5  (1 unrouted)
N$6
  Top 0.61: CMP2.P$3 1334.77,365.76 1334.77,361.95 | 1334.77,361.95 1334.77,358.14 | 1334.77,358.14 1334.77,354.33 | 1334.77,354.33 1334.77,350.52 | 1334.77,350.52 1334.77,346.71 | 1334.77,346.71 1334.77,342.9 | 1334.77,342.9 1334.77,339.09 | 1334.77,339.09 1334.77,335.28 | 1334.77,335.28 1334.77,331.47 | 1334.77,331.47 1334.77,327.66 | 1334.77,327.66 1334.77,323.85 | 1334.77,323.85 1334.77,320.04 | 1334.77,320.04 1334.77,316.23 | 1334.77,316.23 1327.15,316.23 | CMP2.P$16 1334.77,316.23 | CMP2.P$15 1334.77,320.04 | CMP2.P$14 1334.77,323.85 | CMP2.P$13 1334.77,327.66 | CMP2.P$12 1334.77,331.47 | CMP2.P$11 1334.77,335.28 | CMP2.P$10 1334.77,339.09 | CMP2.P$9 1334.77,342.9 | CMP2.P$8 1334.77,346.71 | CMP2.P$7 1334.77,350.52 | CMP2.P$6 1334.77,354.33 | CMP2.P$5 1334.77,358.14 | CMP2.P$4 1334.77,361.95
N$7  (1 unrouted)
N$8
  Top 0.61: 173.99,104.14 173.99,99.69
N$9  (1 unrouted)
N$11
  Top 0.61: CMP15.P$1 49.53,222.25 49.53,218.44 | 49.53,218.44 49.53,214.63 | 49.53,214.63 49.53,210.82 | 49.53,210.82 49.53,207.01 | 49.53,207.01 49.53,203.2 | 49.53,203.2 49.53,199.39 | 49.53,199.39 49.53,195.58 | 49.53,195.58 49.53,191.77 | 49.53,191.77 49.53,187.96 | 49.53,187.96 49.53,184.15 | 49.53,184.15 49.53,180.34 | 49.53,180.34 49.53,176.53 | 49.53,176.53 49.53,172.72 | 49.53,172.72 49.53,168.91 | 49.53,168.91 49.53,165.1 | 49.53,165.1 45.72,165.1 | CMP15.P$16 49.53,165.1 | CMP15.P$15 49.53,168.91 | CMP15.P$14 49.53,172.72 | CMP15.P$13 49.53,176.53 | CMP15.P$12 49.53,180.34 | CMP15.P$11 49.53,184.15 | CMP15.P$10 49.53,187.96 | CMP15.P$9 49.53,191.77 | CMP15.P$8 49.53,195.58 | CMP15.P$2 49.53,218.44 | CMP15.P$4 49.53,210.82 | CMP15.P$3 49.53,214.63 | CMP15.P$5 49.53,207.01 | CMP15.P$6 49.53,203.2 | CMP15.P$7 49.53,199.39
N$12  (1 unrouted)
N$13  (1 unrouted)
N$14
  Top 0.61: 464.19,123.83 464.19,128.27
N$15
  Top 0.61: 501.01,387.99 501.01,392.43
N_N
  Top 0.61: CMP14.P$6 1064.89,292.1 829.31,292.1 829.31,181.61 CMP17.N1
N_XOR_V
  Top 0.61: CMP14.P$12 1010.28,299.72 908.05,299.72 908.05,252.09 | 908.05,252.09 908.05,197.49 CMP5.OUT_P | CMP10.P$1 908.05,252.09
N_XOR_V_N
  Top 0.61: CMP14.P$10 1028.7,297.18 910.59,297.18 910.59,224.79 | 910.59,224.79 910.59,184.15 CMP5.OUT_N | CMP8.P$1 910.59,224.79
NEXT_SPECIFIC  (1 unrouted)
NEXT_XNZVC_MUX_LOGIC
  Top 0.61: CMP3.P$10 1110.62,62.23 975.36,62.23 975.36,137.16 246.38,137.16 246.38,91.44 128.27,91.44 CMP26.EN0
NEXT_XNZVC_MUX_MEMORY
  Top 0.61: CMP3.P$9 1114.42,65.41 977.9,65.41 977.9,139.7 243.84,139.7 243.84,94.61 151.13,94.61 CMP26.EN1
NEXT_XNZVC_MUX_SPECIFIC
  Top 0.61: CMP3.P$8 1118.23,68.58 980.44,68.58 980.44,142.24 240.66,142.24 240.66,97.79 196.85,97.79 CMP26.EN3
OPCODE_IS_ANDI_PS
  Top 0.61: CMP28.AND 513.72,391.16 554.99,391.16 554.99,243.21 596.26,243.21 596.26,147.96 982.98,147.96 982.98,88.9 1122.05,88.9 CMP3.P$7
OPCODE_IS_BRANCH_GROUP
  Top 0.61: CMP13.E 1348.11,182.25 1348.11,127 1330.96,127 1330.96,112.39 1144.9,112.39 CMP3.P$1
OPCODE_IS_ORI_PS
  Top 0.61: CMP28.OR 507.37,394.33 558.8,394.33 558.8,245.11 599.44,245.11 599.44,151.13 985.52,151.13 985.52,92.71 1125.86,92.71 CMP3.P$6
U
  Top 0.61: CMP6.P$4 1237.62,274.32 894.72,274.32 894.72,267.97 CMP7.P
U_N
  Top 0.61: CMP6.P$2 1256.03,271.78 897.89,271.78 897.89,260.35 CMP7.N
V
  Top 0.61: CMP14.P$4 1082.67,289.56 839.47,289.56 839.47,223.52 | CMP17.P3 839.47,223.52 | 839.47,223.52 839.47,194.94 CMP5.P$2
V_N
  Top 0.61: CMP14.P$2 1101.09,287.02 836.93,287.02 836.93,214.63 CMP17.N3
Z
  Top 0.61: CMP6.P$16 1129.03,284.48 918.85,284.48 | 918.85,284.48 834.39,284.48 834.39,207.01 CMP17.P2 | CMP12.P$1 918.85,197.49 918.85,259.71 | CMP10.P$2 918.85,259.71 | 918.85,259.71 918.85,284.48
Z_N
  Top 0.61: CMP6.P$14 1147.44,281.94 905.51,281.94 | 905.51,281.94 831.85,281.94 831.85,198.12 CMP17.N2 | CMP9.P$1 905.51,170.18 905.51,232.41 | CMP8.P$2 905.51,232.41 | 905.51,232.41 905.51,281.94
(copper drawn outside any net)
  shapes: Top circle x38

### Text on the board
tPlace: opcode_is_ori_ps | We can use the logic block to mask out, or set, flags from immediate data via H. | 0 | opcode_is_andi_ps | H | Take Branch Calculation | MATCH | I | Interrupt Enable | MATCH_N | N | Negative | Z | Zero | V | Overflow | X | Extension | If it is a branch instruction we decode the / opcode to give the selected condition. / The appropriate flags are then tested to see if / the branch should be taken. | C | Carry | D | Division mode | U | User | 0 | F0 | Sign R0 | match | F1 | Sign R1 | F2 | Reset action | Decode condition code | 0xt_memory | F3 | End MUL shift | F4 | Div by zero | BUC | Split out flags to test. | F5 | Taken interrupt | BUS | F6 | Op Modifier | BHI | BLS | BCC | BCS | BNE | BEQ | BVC | flag_U | BVS | BPL | flag_C | BMI | flag_V | flag_Z | Not used - set zero | flag_N | BGE | BLT | BGT | 0 | BLE | flags_ / specific | is_branch_group | clock | cc_3 | cc_2 | cc_1 | cc_0 | flag | F6 | F5 | F4 | F3 | F2 | F1 | F0 | U | D | C | X | V | Z | N | I | flag | PS | next_xnzvc_mux_specific | 0 | next_xnzvc_mux_memory | next_xnzvc_mux_logic | PS Mux and Register | next_xnzvc_mux_specific | next_xnzvc_mux_memory | next_xnzvc_mux_logic | 0 | opcode_is_andi_ps | opcode_is_ori_ps | cc_3 | cc_2 | cc_1 | cc_0 | opcode_is_branch_group | This is where the PS register resides. / It may be loaded by : / a) flags reflecting the result of an instruction / b) from memory / c) by setting/clearing flags from ANDI/ORI PS #data | PS_register_ctrl